# EasyEDA Pro project Raspberry_LCD_2023-10-31_10-21-50.eprj

# Board PCB7
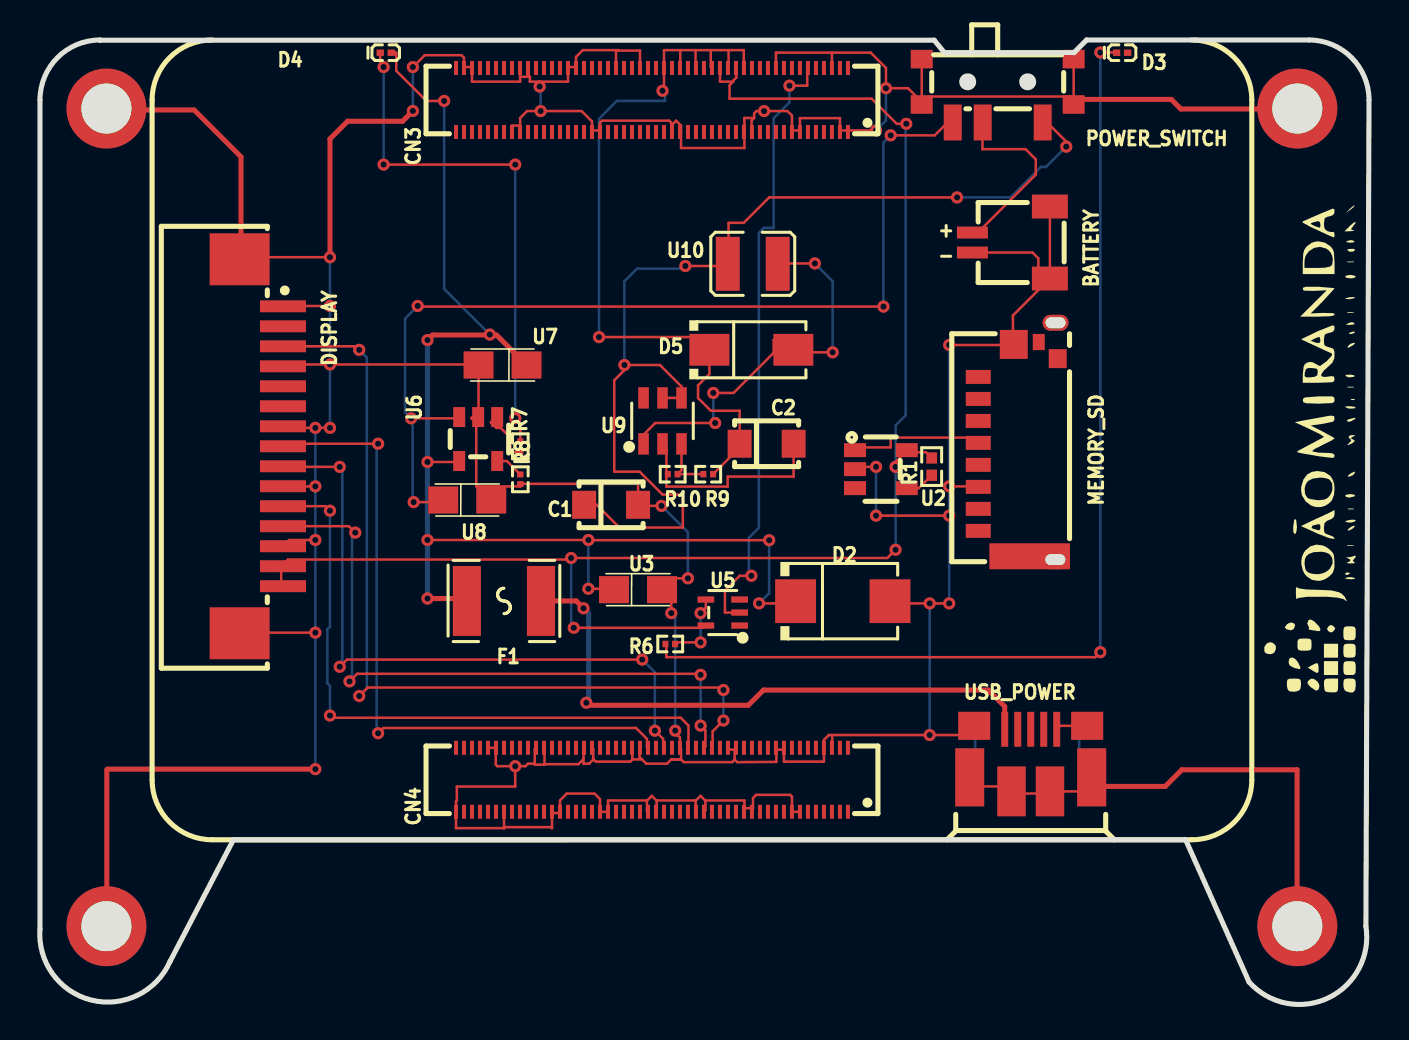
[diagram p0: board, top side]
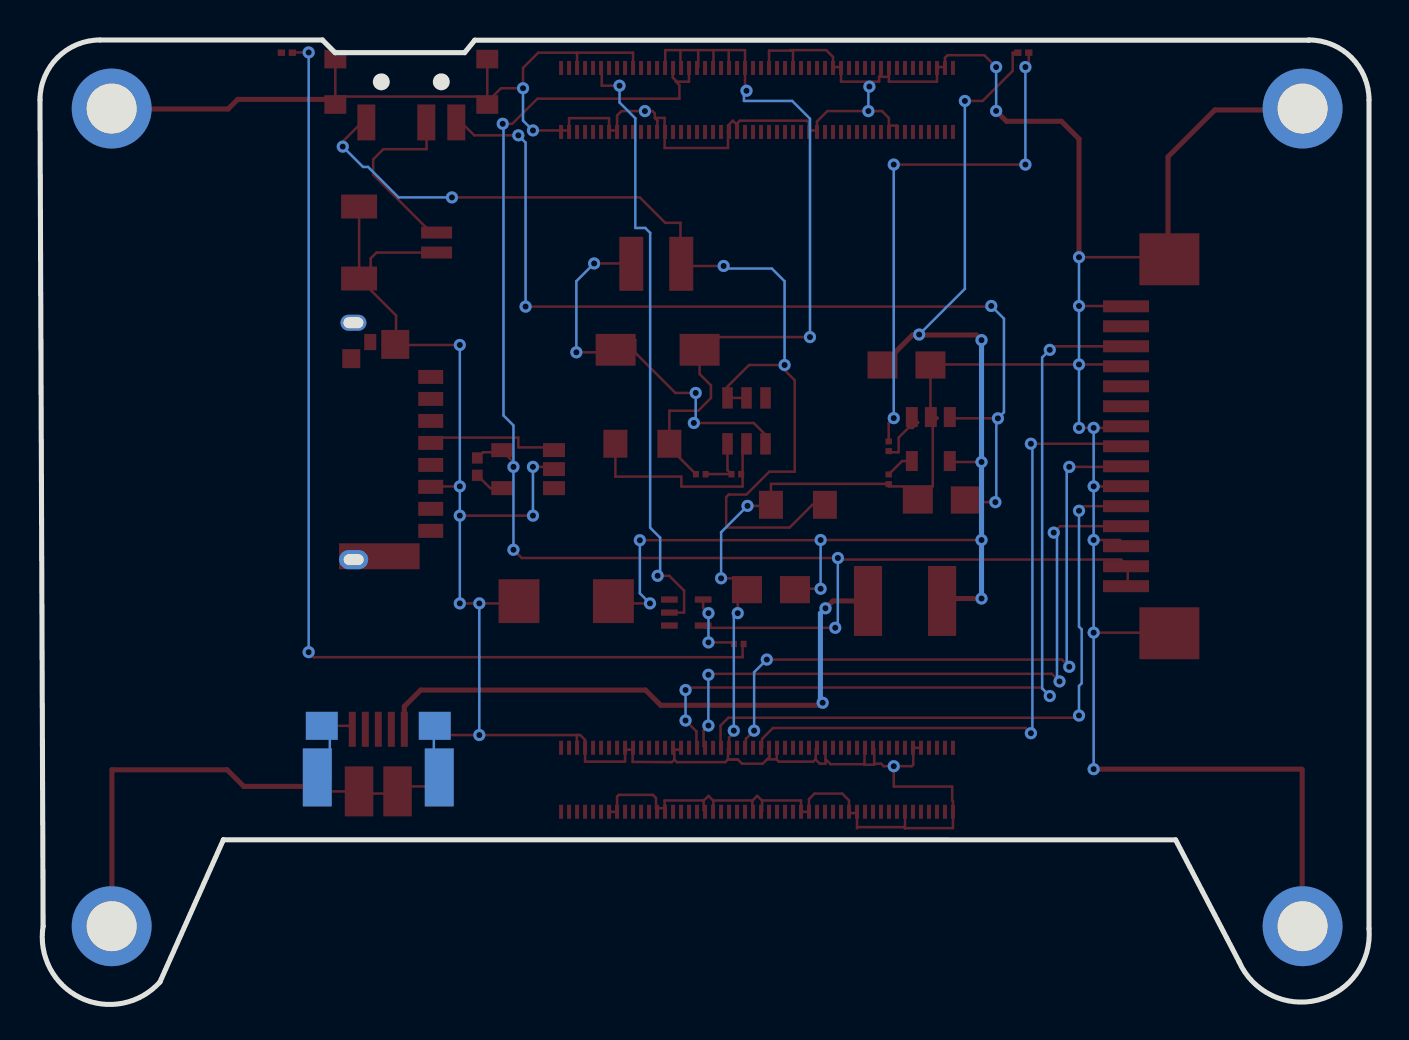
[diagram p1: board, bottom side, seen from below]

Outline 66.48 x 48.24 mm; copper layers: Top Layer, Bottom Layer. Coordinates in mm from the lower left corner of the outline.
Outline path: 0.01,45.24 0.01,3.79 arc(2.56,0.22) 6.51,2.14 9.68,8.23 57.31,8.24 60.48,1.12 arc(64.45,0.33) 66.32,3.91 66.48,45.24 arc(65.6,47.36) 63.48,48.24 52.35,48.24 51.72,47.6 45.24,47.6 44.73,48.23 3.02,48.23 3.01,48.24 arc(0.89,47.36) 0.01,45.24
Stack: Top Layer 0.035mm / Dielectric1 1.51mm FR4 er 4.5 / Bottom Layer 0.035mm

## Design rules (mm)
template: Custom Config
spacing copperThickness1oz (default): track to track 0.102, other pairs 0.152 to 0.3
spacing copperThickness2oz: track to track 0.203, other pairs 0.152 to 0.3
track width copperThickness1oz (default): min 0.127, default 0.127, max 2.54
track width copperThickness2oz: min 0.203, default 0.254, max 2.54
differential pair differentialPair (default): width min 0.127, default 0.254, max 2.54; gap min 0.152, default 0.152
via viaSize (default): diameter min 0.5, default 0.61, max 10; hole min 0.3, default 0.305, max 6.3

## Placement (name value [footprint] x y rotation side)
BATTERY  SM02B-SRSS-TB(LF)(SN)  [CONN-SMD_2P-P1.00_SM02B-SRSS-TB-LF-SN]  48.58 38.11 90 top
C1  22uF  [CAP-SMD_L3.2-W1.6]  28.57 24.99 0 top
C2  22uF  [CAP-SMD_L3.2-W1.6]  36.35 28.04 0 top
CN3  DF40C-100DS-0.4V(51)  [CONN-SMD_DF40C-100DS-0.4V-51]  30.62 45.24 0 top
CN4  DF40C-100DS-0.4V(51)  [CONN-SMD_DF40C-100DS-0.4V-51]  30.62 11.24 0 top
D2  SMBJ5.0A-TR  [SMB_L4.6-W3.6-LS5.3-RD]  40.16 20.17 0 top
D3  -  [L0201-RD]  54.13 47.6 0 top
D4  -  [L0201-RD]  17.3 47.6 0 top
D5  SS14  [SMA_L4.3-W2.5-LS5.0-RD]  35.59 32.74 0 top
DISPLAY  AFA07-S15FCC-00  [FPC-SMD_AFA07-S15FCC-00]  11.08 27.92 270 top
F1  MF-MSMF250/16X-2  [F1812]  23.21 20.18 0 top
MEMORY_SD  MUP-M617-2  [TF-SMD_MUP-M617-2]  48.93 28.17 90 top
NOREF  -  [Pad_e226]  62.89 3.91 0 top
NOREF#2  -  [Pad_e225]  3.33 3.91 0 top
NOREF#3  -  [Pad_e227]  62.89 44.81 0 top
NOREF#4  -  [Pad_e224]  3.33 44.81 0 top
POWER_SWITCH  MK-12C02-G025  [SW-SMD_MK-12C02-G025]  47.91 45.7 180 top
R1  12kΩ  [R0402]  44.61 26.9 90 top
R6  -  [R0201]  31.53 18.03 0 top
R7  4.7kΩ  [R0201]  24.03 27.92 90 top
R8  2kΩ  [R0201]  24.03 26.27 270 top
R9  110kΩ  [R0201]  33.43 26.52 0 top
R10  15kΩ  [R0201]  31.65 26.52 0 top
U2  RT9742GGJ5  [TSOT-23-5_L2.9-W1.6-P0.95-LS2.8-BR]  42.07 26.77 180 top
U3  4.7uF  [CASE-A_3216]  29.92 20.75 0 top
U5  74LVC1G07  [SOT-353_L2.1-W1.3-P0.65-LS2.3-BR]  34.16 19.6 0 top
U6  MCP73831T-2DCI/OT  [SOT-23-5_L2.9-W1.6-P0.95-LS2.8-BL]  21.93 28.28 180 top
U7  4.7uF  [CASE-A_3216]  23.14 31.98 180 top
U8  4.7uF  [CASE-A_3216]  21.38 25.23 0 top
U9  MT3608  [SOT-23-6_L2.9-W1.6-P0.95-LS2.8-BL]  31.15 29.19 0 top
U10  22uH  [IND-SMD_L3.2-W2.5_CKST322512-2.2UH]  35.66 37.04 0 top
USB_POWER  10103594-0001LF  [MICRO-USB-SMD_10103594-0001LF]  49.56 12.3 0 top

## Footprints (pads in the part's own frame, mm; a bottom-side part is the same pattern mirrored in y, then rotated)
CAP-SMD_L3.2-W1.6
  rect 1.2x1.4 smd: 1(-1.35,0) 2(1.35,0)
CASE-A_3216
  rect 1.5x1.359 smd: 1(-1.2,0) 2(1.2,0)
CONN-SMD_2P-P1.00_SM02B-SRSS-TB-LF-SN
  rect 0.6x1.55 smd: 1(-0.5,1.938) 2(0.5,1.938)
  rect 1.2x1.8 smd: 3(1.8,-1.938) 4(-1.8,-1.938)
CONN-SMD_DF40C-100DS-0.4V-51
  rect 0.2x0.7 smd: 1(9.8,-1.6) 2(9.4,-1.6) 3(9,-1.6) 4(8.6,-1.6) 5(8.2,-1.6) 6(7.8,-1.6) 7(7.4,-1.6) 8(7,-1.6) 9(6.6,-1.6) 10(6.2,-1.6) 11(5.8,-1.6) 12(5.4,-1.6) 13(5,-1.6) 14(4.6,-1.6) 15(4.2,-1.6) 16(3.8,-1.6) 17(3.4,-1.6) 18(3,-1.6) 19(2.6,-1.6) 20(2.2,-1.6) 21(1.8,-1.6) 22(1.4,-1.6) 23(1,-1.6) 24(0.6,-1.6) 25(0.2,-1.6) 26(-0.2,-1.6) 27(-0.6,-1.6) 28(-1,-1.6) 29(-1.4,-1.6) 30(-1.8,-1.6) 31(-2.2,-1.6) 32(-2.6,-1.6) 33(-3,-1.6) 34(-3.4,-1.6) 35(-3.8,-1.6) 36(-4.2,-1.6) 37(-4.6,-1.6) 38(-5,-1.6) 39(-5.4,-1.6) 40(-5.8,-1.6) 41(-6.2,-1.6) 42(-6.6,-1.6) 43(-7,-1.6) 44(-7.4,-1.6) 45(-7.8,-1.6) 46(-8.2,-1.6) 47(-8.6,-1.6) 48(-9,-1.6) 49(-9.4,-1.6) 50(-9.8,-1.6) 51(-9.8,1.6) 52(-9.4,1.6) 53(-9,1.6) 54(-8.6,1.6) 55(-8.2,1.6) 56(-7.8,1.6) 57(-7.4,1.6) 58(-7,1.6) 59(-6.6,1.6) 60(-6.2,1.6) 61(-5.8,1.6) 62(-5.4,1.6) 63(-5,1.6) 64(-4.6,1.6) 65(-4.2,1.6) 66(-3.8,1.6) 67(-3.4,1.6) 68(-3,1.6) 69(-2.6,1.6) 70(-2.2,1.6) 71(-1.8,1.6) 72(-1.4,1.6) 73(-1,1.6) 74(-0.6,1.6) 75(-0.2,1.6) 76(0.2,1.6) 77(0.6,1.6) 78(1,1.6) 79(1.4,1.6) 80(1.8,1.6) 81(2.2,1.6) 82(2.6,1.6) 83(3,1.6) 84(3.4,1.6) 85(3.8,1.6) 86(4.2,1.6) 87(4.6,1.6) 88(5,1.6) 89(5.4,1.6) 90(5.8,1.6) 91(6.2,1.6) 92(6.6,1.6) 93(7,1.6) 94(7.4,1.6) 95(7.8,1.6) 96(8.2,1.6) 97(8.6,1.6) 98(9,1.6) 99(9.4,1.6) 100(9.8,1.6)
F1812
  rect 1.407x3.499 smd: 1(-1.853,0) 2(1.853,0)
FPC-SMD_AFA07-S15FCC-00
  rect 0.6x2.3 smd: 1(-7,1.083) 2(-6,1.083) 3(-5,1.083) 4(-4,1.083) 5(-3,1.083) 6(-2,1.083) 7(-1,1.083) 8(0,1.083) 9(1,1.083) 10(1.998,1.085) 11(2.998,1.085) 12(3.998,1.085) 13(4.998,1.085) 14(6,1.083) 15(6.998,1.085)
  rect 2.6x3 smd: 16(-9.352,-1.085) 17(9.352,-1.085)
IND-SMD_L3.2-W2.5_CKST322512-2.2UH
  rect 1.2x2.7 smd: 1(-1.25,0) 2(1.25,0)
L0201-RD
  rect 0.368x0.324 smd: 1(-0.275,0) 2(0.275,0)
MICRO-USB-SMD_10103594-0001LF
  rect 0.35x1.75 smd: 1(-1.3,1.465) 2(-0.65,1.465) 3(0,1.465) 4(0.65,1.465) 5(1.3,1.465)
  custom 1.45x2.9 hole 0.7x1.2: 6(-2.775,-1.39) 6(2.775,-1.39)
  custom 1.6x1.4 hole 0.65x1.05: 6(-2.425,1.64)
  rect 1.425x2.5 smd: 6(-0.963,-1.64) 6(0.963,-1.64)
  custom 1.6x1.4 hole 1.05x0.65: 6(2.425,1.64)
Pad_e224
  round 4 hole 2.5: 1(0,0)
Pad_e225
  round 4 hole 2.5: 2(0,0)
Pad_e226
  round 4 hole 2.5: 3(0,0)
Pad_e227
  round 4 hole 2.5: 4(0,0)
R0201
  rect 0.303x0.324 smd: 1(-0.241,0) 2(0.241,0)
R0402
  rect 0.566x0.54 smd: 1(-0.433,0) 2(0.433,0)
SMA_L4.3-W2.5-LS5.0-RD
  rect 2x1.593 smd: 1(-2.1,0) 2(2.1,0)
SMB_L4.6-W3.6-LS5.3-RD
  rect 2.047x2.192 smd: 1(-2.361,0) 2(2.361,0)
SOT-23-5_L2.9-W1.6-P0.95-LS2.8-BL
  rect 0.6x1 smd: 1(-0.95,-1.1) 2(0,-1.1) 3(0.95,-1.1) 4(0.95,1.1) 5(-0.95,1.1)
SOT-23-6_L2.9-W1.6-P0.95-LS2.8-BL
  rect 0.532x1.072 smd: 1(-0.95,-1.149) 2(0,-1.149) 3(0.95,-1.149) 4(0.95,1.149) 5(0,1.149) 6(-0.95,1.149)
SOT-353_L2.1-W1.3-P0.65-LS2.3-BR
  rect 0.839x0.315 smd: 1(0.845,-0.65) 2(0.845,0) 3(0.845,0.65) 4(-0.845,0.65) 5(-0.845,-0.65)
SW-SMD_MK-12C02-G025
  rect 0.9x1.8 smd: 1(-2.25,1.583) 2(0.75,1.583) 3(2.25,1.583)
  rect 1.1x0.93 smd: 4(3.8,0.686) 5(3.8,-1.583) 6(-3.8,-1.583) 7(-3.8,0.686)
TF-SMD_MUP-M617-2
  rect 0.7x1.25 smd: 1(3.215,1.988) 2(2.115,1.988) 3(1.015,1.988) 4(-0.085,1.988) 5(-1.185,1.988) 6(-2.285,1.988) 7(-3.385,1.988) 8(-4.485,1.988)
  rect 0.81x0.6 smd: 9(4.96,-1.038)
  rect 0.95x0.9 smd: 10(4.13,-1.988)
  rect 1.45x1.4 smd: 11(4.84,0.212)
  oval 0.96x1.46 hole 0.55x1: 12(-5.925,-1.867)
  rect 1.3x4.03 smd: 12(-5.755,-0.583)
  oval 0.8x1.3 hole 0.55x1: 13(5.925,-1.877)
TSOT-23-5_L2.9-W1.6-P0.95-LS2.8-BR
  rect 1.1x0.7 smd: 1(1.294,-0.951) 2(1.294,-0.001) 3(1.294,0.951) 4(-1.294,0.951) 5(-1.294,-0.949)

## Nets
3.3V: CN3.84 CN3.86 DISPLAY.14 DISPLAY.15 R1.2 U2.5 U5.5
+3.3V: D3.2
+5V: C2.1 CN3.77 CN3.79 CN3.81 CN3.83 CN3.85 CN3.87 D5.1 R9.2
+5V_USB: D2.1 D4.2 F1.1 U3.1 U6.4 U7.1
GND: BATTERY.1 BATTERY.3 BATTERY.4 C1.2 CN3.1 CN3.2 CN3.7 CN3.8 CN3.13 CN3.14 CN3.22 CN3.23 CN3.32 CN3.33 CN3.42 CN3.43 CN3.52 CN3.53 CN3.59 CN3.60 CN3.65 CN3.66 CN3.71 CN3.74 CN3.91 CN3.98 CN4.7 CN4.8 CN4.13 CN4.14 CN4.19 CN4.20 CN4.25 CN4.26 CN4.31 CN4.32 CN4.37 CN4.38 CN4.44 CN4.50 CN4.55 CN4.56 CN4.61 CN4.62 CN4.67 CN4.68 CN4.73 CN4.74 CN4.79 CN4.85 CN4.86 CN4.91 CN4.92 CN4.97 CN4.98 D2.2 DISPLAY.1 DISPLAY.4 DISPLAY.7 DISPLAY.10 DISPLAY.13 DISPLAY.16 DISPLAY.17 MEMORY_SD.6 MEMORY_SD.11 NOREF.3 NOREF#2.2 NOREF#3.4 NOREF#4.1 POWER_SWITCH.4 POWER_SWITCH.5 POWER_SWITCH.6 POWER_SWITCH.7 R8.2 U2.2 U3.2 U6.2 U7.2 U8.2 USB_POWER.5 USB_POWER.6
BAT+: BATTERY.2 POWER_SWITCH.2
BAT_IN: C1.1 POWER_SWITCH.1 U9.4 U9.5 U10.1
DSI1_C_N: CN4.75 DISPLAY.8
DSI1_C_P: CN4.77 DISPLAY.9
DSI1_D0_N: DISPLAY.2
DSI1_D0_P: CN4.83 DISPLAY.3
NET4: POWER_SWITCH.3 U6.3 U8.1
NET19: DISPLAY.5
NET20: DISPLAY.6
NET21: CN4.80 DISPLAY.11
NET22: CN4.82 DISPLAY.12
NPWR_LED: CN3.95 U5.2
POWER_GND: U5.3
SD_CLOCK: MEMORY_SD.5
SD_DAT2: CN3.69
SD_POWER_ON: CN3.75
$1N3655: MEMORY_SD.1
$1N3691: MEMORY_SD.4 U2.1
$1N3772: R1.1 U2.4
$1N3962: MEMORY_SD.2
$1N3973: MEMORY_SD.3
$1N4000: CN3.61
$1N4038: CN3.62
$1N4567: CN4.81
$1N5777: CN4.87
$1N5788: CN4.89
$1N5838: CN3.57
$1N9478: F1.2 USB_POWER.1
$1N9600: D3.1 R6.1
$1N9766: R6.2 U5.4
$1N10820: D4.1 R7.2
$1N10824: R7.1 U6.1
$1N10845: R8.1 U6.5
$1N11272: D5.2 U9.1 U10.2
$1N11417: R9.1 R10.2 U9.3
$1N11482: C2.2 R10.1 U9.2

Pads without a net: CN3 3 4 5 6 9 10 11 12 15 16 17 18 19 20 21 24 25 26 27 28 29 30 31 34 35 36 37 38 39 40 41 44 45 46 47 48 49 50 51 54 55 56 58 63 64 67 68 70 72 73 76 78 80 82 88 89 90 92 93 94 96 97 99 100; CN4 1 2 3 4 5 6 9 10 11 12 15 16 17 18 21 22 23 24 27 28 29 30 33 34 35 36 39 40 41 42 43 45 46 47 48 49 51 52 53 54 57 58 59 60 63 64 65 66 69 70 71 72 76 78 84 88 90 93 94 95 96 99 100; MEMORY_SD 7 8 9 10 12 13; U2 3; U5 1; U9 6; USB_POWER 2 3 4

## Via types
v1: diameter 0.61, hole 0.305, Top Layer to Bottom Layer, 87 vias

## Routing (per net, layer and track width the routed paths; a pad name or vN(x,y) marks a point on that pad's centre or on a via; arc(x,y) is an arc through that point)
3.3V: length 78.9
  Top Layer w0.127: 43.29,27.62 42.8,27.13 v1(42.8,26.88) ; 43.29,27.62 44.32,27.62 44.61,27.33 ; 43.29,27.62 43.29,27.65 U2.5 ; 34.67,46.15 34.67,46.2 34.83,46.36 34.83,46.82 CN3.86 ; 34.67,46.15 34.02,46.15 34.02,46.83 CN3.84 ; 34.67,46.15 34.5,45.98 34.5,45.3 41.6,45.3 42.86,44.04 v1(43.34,44.04) ; 12.07,21.91 12.07,21.01 DISPLAY.15 ; 12.07,21.91 12.41,22.25 26.5,22.25 v1(26.57,22.33) 42.39,22.33 v1(42.8,22.74) ; 12.07,21.91 DISPLAY.14 ; v1(26.71,18.84) 33.2,18.84 33.31,18.95
  Bottom Layer w0.127: v1(26.71,18.84) 26.58,18.96 26.58,22.32 v1(26.57,22.33) ; v1(43.34,44.04) 43.3,44.08 43.3,29.46 42.8,28.96 v1(42.8,26.88) v1(42.8,22.74)
+5V: length 40.2
  Top Layer w0.127: CN3.85 34.45,46.86 34.45,47.73 ; 32.03,47.73 31.22,47.73 CN3.77 31.22,45.77 v1(31.14,45.69) ; 32.03,47.73 32.03,46.85 CN3.79 ; 32.03,47.73 32.8,47.73 ; CN3.81 32.8,46.86 32.8,47.73 ; 33.56,47.73 33.56,46.89 CN3.83 ; 33.56,47.73 34.45,47.73 ; 33.56,47.73 32.8,47.73 ; CN3.87 35.21,46.84 35.21,47.73 34.45,47.73 ; v1(27.97,33.38) 32.85,33.38 D5.1 33.49,31.53 32.92,30.96 32.92,30.33 33.56,29.69 35,29.69 C2.1 35,27.85 R9.2
  Bottom Layer w0.127: v1(31.15,45.7) 31.27,45.57 31.27,45.19 28.86,45.19 27.97,44.3 v1(27.97,33.38)
+5V_USB: length 65.1
  Top Layer w0.127: v1(36.48,23.22) 27.45,23.22 v1(27.44,23.23) v1(19.39,23.23) ; U3.1 28.68,20.79 v1(27.44,20.79) ; v1(20.22,45.19) 19.33,45.19 17.83,46.69 17.83,47.6 D4.2 ; v1(19.39,27.13) 20.93,27.13 U6.4 ; v1(35.97,20.06) 37.69,20.06 D2.1
  Top Layer w0.254: v1(19.39,20.3) 21.24,20.3 F1.1 ; v1(19.39,33.23) 19.65,33.48 22.49,33.48 v1(22.51,33.51) 22.53,33.48 22.84,33.48 U7.1
  Bottom Layer w0.127: v1(22.51,33.5) 20.22,35.79 v1(20.22,45.19) ; v1(35.97,20.06) 36.48,20.56 v1(36.48,23.22) ; v1(27.44,20.79) v1(27.44,23.23)
  Bottom Layer w0.254: v1(19.39,33.23) v1(19.39,27.13) v1(19.39,23.23) v1(19.39,20.3)
GND: length 358.1
  Top Layer w0.127: DISPLAY.4 12.25,32.01 v1(14.51,32.01) 21.92,32.01 U7.2 21.94,29.68 21.59,29.32 ; CN3.22 32.07,43.63 ; 32.07,43.63 32.07,42.83 35.24,42.83 35.24,43.63 ; 32.07,43.63 32.07,43.95 31.83,44.2 31.58,43.95 ; 29.63,12.25 29.63,12.24 29.53,12.14 27.81,12.14 27.68,12.27 ; 29.63,12.25 30.12,12.25 ; 29.63,12.25 29.63,12.82 CN4.73 ; 34.75,12.24 34.88,12.12 36.84,12.13 36.84,12.72 36.82,12.74 ; 34.75,12.24 34.75,12.74 ; 34.75,12.24 34.63,12.12 32.21,12.12 32.07,12.25 ; 39.62,47.6 41.56,47.6 42.32,46.84 v1(42.32,45.82) 43.42,45.82 43.98,45.26 44.11,45.26 ; 39.62,47.6 CN3.98 ; 39.62,47.6 36.82,47.6 36.82,47.59 CN3.91 ; 37.62,43.71 37.62,44.45 37.39,44.68 v1(36.23,44.68) 35.84,44.68 35.73,44.56 35.73,44.34 ; 37.62,43.71 CN3.8 ; 37.62,43.71 38.02,43.71 ; 24.76,12.04 24.76,11.99 25.24,11.99 25.24,12.02 ; 24.76,12.04 24.76,12.77 CN4.61 ; 24.76,12.04 24.41,12.04 24.29,11.91 v1(23.78,11.91) ; 33.29,10.19 33.29,10.2 35.24,10.2 35.24,10.2 35.24,9.81 ; 33.29,10.19 33.29,9.71 CN4.19 ; 33.29,10.19 33.05,10.43 32.8,10.19 ; DISPLAY.13 12.47,23.23 v1(13.78,23.23) ; v1(31.1,24.93) 29.92,24.93 29.92,26.04 24.16,26.04 24.03,25.91 ; CN4.98 39.63,12.85 39.63,13.47 ; v1(32.42,21.31) 31.66,21.31 31.1,20.74 ; CN4.56 22.8,12.82 ; 22.8,12.82 22.8,12.83 22.8,12.83 CN4.55 ; 22.8,12.82 22.8,11.99 22.88,11.91 v1(23.78,11.91) ; CN3.33 27.62,43.71 ; 27.62,43.71 27.62,44.16 27.1,44.68 v1(25.05,44.68) 24.37,44.68 24.02,44.34 24.02,43.95 ; 27.62,43.71 28.02,43.71 ; CN4.86 34.82,12.81 34.75,12.74 ; 37.22,12.74 36.82,12.74 ; 37.22,12.74 CN4.92 ; 37.22,12.74 37.22,12.14 39.22,12.14 CN4.97 39.21,12.85 39.22,12.86 39.22,13.23 39.46,13.47 39.63,13.47 ; 36.82,12.74 CN4.91 ; 30.36,10.19 30.36,9.69 CN4.26 ; 30.36,10.19 30.36,10.2 30.36,10.2 28.42,10.2 CN4.31 CN4.32 28.02,10.27 27.74,10.54 26.36,10.54 26.02,10.21 26.02,9.57 25.62,9.57 ; 30.36,10.19 30.61,10.43 30.85,10.19 ; 23.22,8.82 23.22,8.81 23.27,8.86 25.57,8.86 25.62,8.82 25.62,9.57 ; 23.22,8.82 20.82,8.82 CN4.50 20.82,10.16 20.86,10.2 20.86,10.9 23.78,10.9 v1(23.78,11.91) ; 23.22,8.82 CN4.44 ; 24.02,43.95 23.62,43.95 CN3.43 ; 24.02,43.95 24.02,43.64 CN3.42 ; 32.07,12.25 32.07,12.24 31.59,12.24 31.58,12.25 ; 32.07,12.25 32.07,12.78 CN4.79 32.02,13.34 31.78,13.58 v1(31.78,13.69) ; 32.07,12.25 31.58,12.25 ; 35.67,9.81 35.62,9.76 CN4.13 ; 35.67,9.81 35.24,9.81 ; 35.67,9.81 35.67,10.32 35.83,10.48 37.53,10.48 37.62,10.39 CN4.8 CN4.7 ; CN4.67 27.19,12.81 27.19,12.27 ; 24.51,46.39 24.02,46.39 ; 24.51,46.39 24.38,46.52 24.38,46.8 CN3.60 ; 24.51,46.39 24.51,46.15 25,46.15 ; 24.02,46.39 24.02,46.15 21.62,46.15 21.62,46.88 21.22,46.88 ; 24.02,46.39 24.02,46.83 CN3.59 ; 34.75,12.74 34.51,12.74 CN4.85 ; USB_POWER.6 51.04,13.93 USB_POWER.5 ; CN3.71 28.82,47.7 28.95,47.7 ; USB_POWER.6 48.6,10.55 ; 48.6,10.55 48.24,10.9 USB_POWER.6 ; 48.6,10.55 50.42,10.55 USB_POWER.6 52.09,10.65 USB_POWER.6 ; USB_POWER.6 46.67,13.47 v1(44.51,13.47) 39.63,13.47 ; 21.22,46.88 CN3.52 ; 21.22,46.88 21.22,47.35 21.09,47.47 19.25,47.47 v1(18.66,46.88) ; U8.2 21.9,25.91 ; 21.9,25.91 24.03,25.91 ; 21.9,25.91 21.83,25.91 21.83,29.08 21.59,29.32 ; 31.58,43.95 31.58,43.71 31.62,43.71 CN3.23 ; 31.58,43.95 31.58,44.09 31.47,44.2 28.13,44.2 28.02,44.09 28.02,43.71 ; 31.58,12.25 31.37,12.04 30.33,12.04 30.12,12.25 ; 30.12,12.25 29.99,12.38 29.99,12.81 CN4.74 ; 27.19,12.27 26.94,12.02 25.24,12.02 ; 27.19,12.27 27.19,12.04 27.48,12.04 27.68,12.24 27.68,12.27 ; U2.2 40.88,26.88 v1(41.82,26.88) ; 25.62,9.57 CN4.38 ; 21.59,29.32 21.87,29.32 U6.2 ; v1(41.82,43.71) 40.42,43.71 ; 40.42,43.71 40.02,43.71 ; 40.42,43.71 CN3.1 ; 40.02,43.71 40.02,44.33 38.02,44.33 38.02,43.71 ; 40.02,43.71 CN3.2 ; 31.1,20.74 31.58,20.26 v1(31.58,19.57) ; 31.1,20.74 U3.2 ; 25.24,12.02 25.24,12.81 CN4.62 ; 28.95,47.7 28.95,47.73 27.16,47.73 26.82,47.39 26.82,46.88 ; 28.95,47.7 30.02,47.7 CN3.74 ; BATTERY.3 BATTERY.4 ; BATTERY.4 49.94,36.88 49.94,37.31 49.65,37.6 BATTERY.1 ; BATTERY.4 48.67,34.46 48.67,33.05 MEMORY_SD.11 48.68,32.98 v1(45.48,32.98) ; CN3.32 28.02,43.71 ; v1(14.51,34.93) 12.18,34.93 DISPLAY.1 ; 24.03,25.91 R8.2 ; DISPLAY.10 12.17,25.91 v1(13.78,25.91) ; 30.85,10.19 30.85,9.67 CN4.25 ; 30.85,10.19 30.85,10.2 30.86,10.2 32.8,10.2 32.8,10.2 32.8,10.19 ; 44.11,45.26 44.11,47.53 ; 44.11,45.26 44.24,45.14 44.51,45.41 51.56,45.41 51.71,45.26 51.71,47.53 ; v1(13.78,18.59) 10.02,18.59 DISPLAY.17 ; 25,46.15 26.42,46.15 26.42,46.88 26.82,46.88 ; 25,46.15 v1(25,45.9) ; 32.8,10.19 32.8,9.65 CN4.20 ; 27.68,12.27 27.68,12.77 CN4.68 ; CN3.14 35.24,43.63 ; 35.24,43.63 35.24,44.34 35.73,44.34 ; 26.82,46.88 CN3.66 ; 35.73,44.34 35.6,44.21 35.6,43.65 CN3.13 ; v1(45.48,20.06) v1(44.51,20.06) 42.63,20.06 D2.2 ; v1(45.48,25.91) 46.91,25.91 MEMORY_SD.6 ; 35.24,9.81 35.24,9.66 CN4.14 ; v1(14.51,37.37) 10.1,37.37 DISPLAY.16 ; v1(14.51,28.84) v1(13.78,28.84) 12.24,28.84 DISPLAY.7 ; 38.02,43.71 CN3.7 ; v1(41.82,24.45) v1(45.48,24.45)
  Top Layer w0.254: v1(13.78,11.77) 3.38,11.77 3.35,11.73 3.35,3.93 NOREF#2.2 ; 51.71,45.26 56.59,45.26 57.07,44.78 62.83,44.78 62.88,44.73 ; NOREF.3 62.88,3.92 62.88,11.73 57.12,11.73 56.29,10.9 USB_POWER.6 ; v1(18.66,44.69) 18.14,44.17 15.4,44.17 14.51,43.29 v1(14.51,37.37) ; 3.38,44.73 7.72,44.73 10.06,42.39 10.06,37.4 10.1,37.37
  Bottom Layer w0.127: v1(41.82,26.88) v1(41.82,24.45) ; v1(32.42,21.31) 32.42,23.61 v1(31.1,24.93) ; v1(41.82,43.71) 42.32,44.21 v1(42.32,45.82) ; v1(13.78,28.84) v1(13.78,25.91) v1(13.78,23.23) v1(13.78,18.59) v1(13.78,11.77) ; USB_POWER.6 51.98,11.25 USB_POWER.6 ; v1(14.51,28.84) v1(14.51,32.01) v1(14.51,34.93) v1(14.51,37.37) ; v1(18.66,46.88) v1(18.66,44.69) ; v1(31.58,19.57) 31.78,19.37 v1(31.78,13.69) ; USB_POWER.6 46.79,13.58 USB_POWER.6 ; v1(44.51,20.06) v1(44.51,13.47) ; v1(25.05,44.68) 25.05,45.86 v1(25,45.9) ; v1(45.48,20.06) v1(45.48,24.45) v1(45.48,25.91) v1(45.48,32.98)
BAT+: length 9.4
  Top Layer w0.127: BATTERY.2 46.91,38.6 49.81,41.5 49.81,42.27 49.31,42.77 47.15,42.77 47.15,44.1 POWER_SWITCH.2
BAT_IN: length 53.3
  Top Layer w0.127: U9.5 U9.4 32.1,30.9 31.02,31.98 v1(29.24,31.98) 29.24,31.72 28.73,31.22 28.73,26.64 30,26.64 31.14,25.5 32.03,25.5 32.16,25.37 32.16,23.85 28.99,23.85 27.85,24.99 C1.1 ; v1(51.34,42.9) 51.34,43.15 50.38,44.11 POWER_SWITCH.1 ; v1(45.88,40.36) 36.48,40.36 35.21,39.09 34.45,39.09 34.45,37.08 U10.1 34.3,36.93 v1(32.29,36.93)
  Bottom Layer w0.127: v1(32.29,36.93) 32.16,36.8 29.88,36.8 29.24,36.17 v1(29.24,31.98) ; v1(45.88,40.36) 48.54,40.36 50.07,41.88 50.32,41.88 v1(51.34,42.9)
DSI1_C_N: length 33.6
  Top Layer w0.127: v1(16.92,28.04) 12.29,28.04 DISPLAY.8 ; v1(16.92,13.56) 17.18,13.82 29.82,13.82 30.36,13.28 30.36,12.89 CN4.75
  Bottom Layer w0.127: v1(16.92,28.04) 16.85,27.97 16.85,13.64 v1(16.92,13.57)
DSI1_C_P: length 33.3
  Top Layer w0.127: v1(15,16.89) 15.36,17.25 v1(30.13,17.25) ; v1(15,26.88) 12.19,26.88 DISPLAY.9 ; v1(30.76,13.69) 31.18,13.28 31.18,12.74 31.22,12.74 CN4.77
  Bottom Layer w0.127: v1(30.76,13.69) 30.76,16.61 v1(30.13,17.25) ; v1(15,16.89) 15.13,17.01 15.13,26.76 v1(15,26.88)
DSI1_D0_P: length 43.1
  Top Layer w0.127: v1(15.98,32.74) 15.8,32.91 DISPLAY.3 ; CN4.83 33.65,12.87 33.65,13.66 v1(34.19,14.2) ; v1(34.19,15.72) 34.07,15.85 16.4,15.85 v1(15.98,15.42)
  Bottom Layer w0.127: v1(15.98,32.74) 16.36,32.36 16.36,15.81 v1(15.98,15.43) ; v1(34.19,14.2) v1(34.19,15.73)
NET4: length 49.6
  Top Layer w0.127: v1(18.7,25.12) 20.07,25.12 U8.1 ; U6.3 20.91,29.31 v1(18.57,29.31) ; v1(18.9,34.93) 18.93,34.9 v1(42.19,34.9) ; v1(42.56,43.47) 44.76,43.47 45.41,44.11 POWER_SWITCH.3
  Bottom Layer w0.127: v1(18.7,25.12) 18.65,25.17 18.65,29.23 v1(18.57,29.31) 18.27,29.62 18.27,34.3 v1(18.9,34.93) ; v1(42.56,43.47) 42.19,43.1 v1(42.19,34.9)
NET21: length 32.1
  Top Layer w0.127: v1(14.51,24.69) 14.29,24.92 DISPLAY.11 ; CN4.80 32.44,12.86 32.44,13.95 32.05,14.34 14.62,14.34 v1(14.51,14.45)
  Bottom Layer w0.127: v1(14.51,14.45) 14.51,15.93 14.38,16.06 14.38,18.76 14.51,18.89 v1(14.51,24.69)
NET22: length 32.8
  Top Layer w0.127: v1(33.05,16.48) 33,16.54 15.87,16.54 v1(15.49,16.15) ; v1(33.05,13.94) 33.29,13.7 33.29,12.91 CN4.82 ; DISPLAY.12 15.46,23.92 v1(15.78,23.6)
  Bottom Layer w0.127: v1(15.78,23.6) 15.62,23.43 15.62,16.28 v1(15.49,16.15) ; v1(33.05,16.48) v1(33.05,13.94)
NPWR_LED: length 31
  Top Layer w0.127: v1(35.59,21.44) 35.01,21.44 34.27,20.7 34.27,19.6 U5.2 ; CN3.95 38.38,46.8 38.38,45.95 v1(37.5,45.95)
  Bottom Layer w0.127: v1(37.5,45.95) 37.5,45.11 36.7,44.32 36.7,38.83 36.21,38.83 35.96,38.59 35.96,23.84 35.46,23.34 35.46,21.56 v1(35.59,21.44)
$1N3691: length 7.1
  Top Layer w0.127: U2.1 40.85,27.72 40.85,27.86 42.56,27.86 42.56,28.35 46.94,28.35 MEMORY_SD.4
$1N3772: length 1.5
  Top Layer w0.127: U2.4 43.96,25.82 R1.1
$1N9478: length 29.9
  Top Layer w0.254: USB_POWER.1 48.26,14.9 47.44,15.72 36.2,15.72 35.43,14.96 27.46,14.96 v1(27.34,15.09) ; v1(27.19,19.81) 26.83,20.18 F1.2
  Bottom Layer w0.254: v1(27.34,15.09) 27.45,15.2 27.45,19.56 v1(27.19,19.82)
$1N9600: length 53.3
  Top Layer w0.127: R6.1 31.34,17.98 31.34,17.36 52.79,17.36 v1(53.04,17.62) ; v1(53.04,47.61) 53.85,47.61 D3.1
  Bottom Layer w0.127: v1(53.04,47.61) v1(53.04,17.62)
$1N9766: length 3.6
  Top Layer w0.127: v1(33.05,18.11) 31.85,18.11 R6.2 ; 33.31,20.25 33.31,19.84 v1(33.05,19.57)
  Bottom Layer w0.127: v1(33.05,19.57) v1(33.05,18.11)
$1N10820: length 26.2
  Top Layer w0.127: R7.2 24.03,29.07 v1(23.78,29.32) ; v1(17.2,46.88) 17.03,47.05 D4.1 ; v1(23.78,42) v1(17.2,42)
  Bottom Layer w0.127: v1(17.2,42.01) v1(17.2,46.88) ; v1(23.78,29.33) v1(23.78,42.01)
$1N10824: length 3
  Top Layer w0.127: R7.1 23.98,27.62 23.54,27.62 23.54,28.35 23.05,28.84 22.83,28.84 22.56,29.11 22.83,29.38 U6.1
$1N10845: length 1.4
  Top Layer w0.127: U6.5 23.36,27.18 R8.1
$1N11272: length 21.3
  Top Layer w0.127: v1(33.69,30.58) 34.7,30.58 36.7,32.59 36.7,33.22 ; U9.1 30.2,28.49 30.78,29.08 v1(33.78,29.08) ; 36.7,33.22 37.32,32.61 v1(39.65,32.61) ; 36.7,33.22 37.62,33.22 37.74,33.1 ; U10.2 36.93,37.06 v1(38.76,37.06)
  Bottom Layer w0.127: v1(39.65,32.61) 39.65,36.17 v1(38.76,37.06) ; v1(33.78,29.08) 33.69,29.17 v1(33.69,30.58)
$1N11417: length 2.9
  Top Layer w0.127: U9.3 32.1,26.72 31.9,26.52 ; 31.9,26.52 33.18,26.52 R9.1 ; 31.9,26.52 R10.2
$1N11482: length 10.8
  Top Layer w0.127: 31.34,26.52 31.34,27.84 U9.2 ; 31.34,26.52 31.34,25.9 34.4,25.9 34.4,26.4 37.7,26.4 C2.2 ; 31.34,26.52 R10.1

## Text on the board
Top Silkscreen Layer: + | -

# Board rpi-cm4-carrier-template
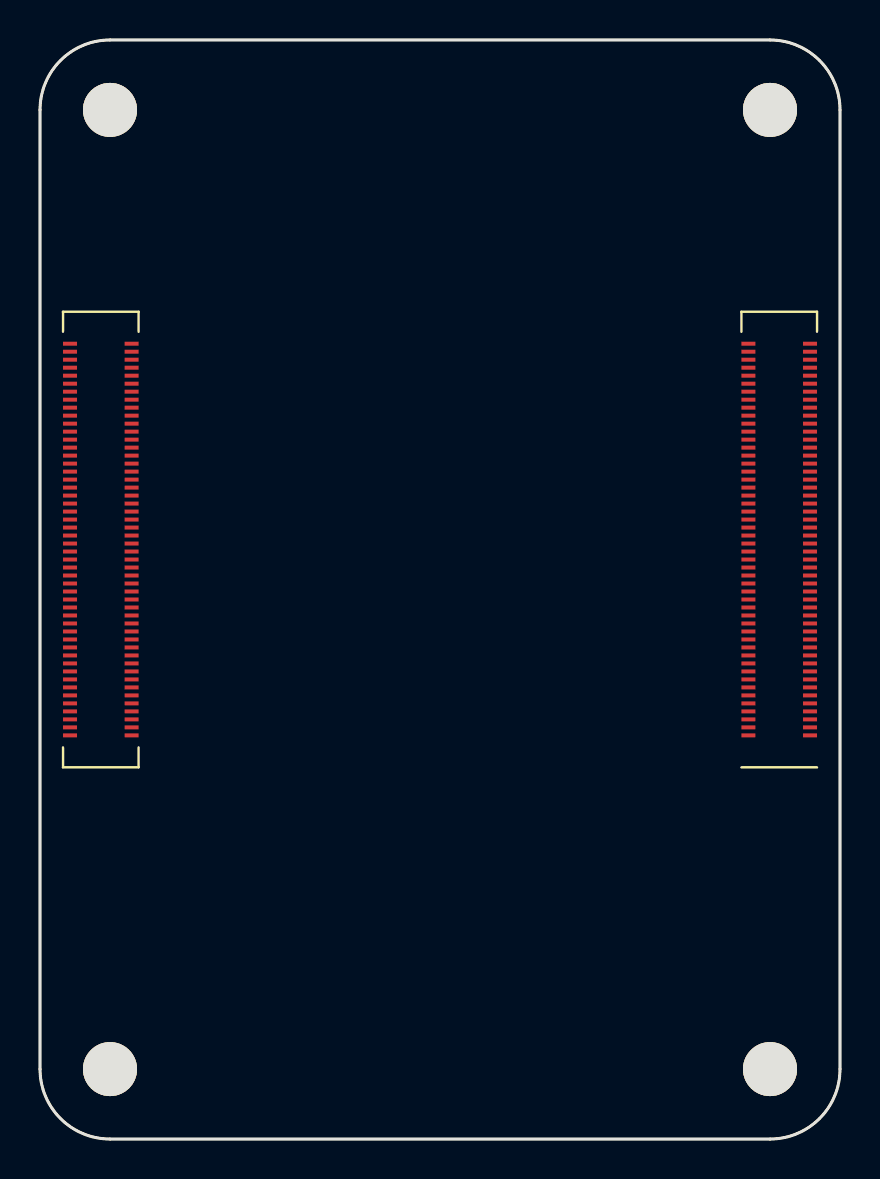
[diagram p2: board, top side]
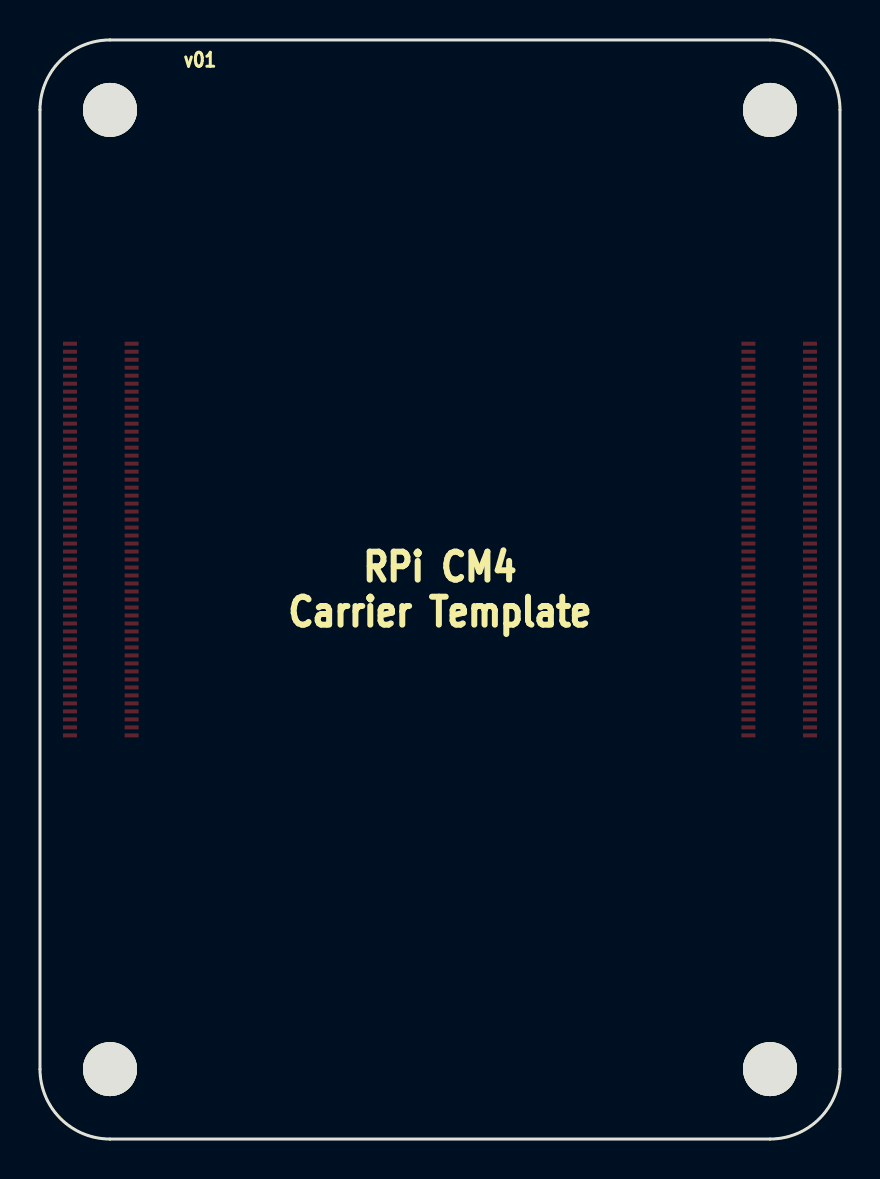
[diagram p3: board, bottom side, seen from below]

Outline 40 x 55 mm; copper layers: Top Layer, Bottom Layer. Coordinates in mm from the lower left corner of the outline.
Outline path: 0,51.5 0,3.5 arc(1.03,1.03) 3.5,0 36.5,0 arc(38.97,1.03) 40,3.5 40,51.5 arc(38.97,53.97) 36.5,55 3.5,55 arc(1.03,53.97) 0,51.5
Stack: Top Layer 0.0009mm / dielectric 1 0.0384mm FR4 er 4.5 / Bottom Layer 0.0009mm

## Design rules (mm)
spacing safeClearance (default): track to track 0.152, other pairs 0.152 to 0.3
track width trackWidth (default): min 0.127, default 0.254, max 2.54
differential pair differentialPair (default): width min 0.127, default 0.254, max 2.54; gap min 0.152, default 0.152
via viaSize (default): diameter min 0.5, default 0.61, max 10; hole min 0.3, default 0.305, max 6

## Placement (name value [footprint] x y rotation side)
MODULE1  ComputeModule4-CM4  [CM4IO:Raspberry-Pi-4-Compute-Module]  36.5 51.5 180 top

## Footprints (pads in the part's own frame, mm; a bottom-side part is the same pattern mirrored in y, then rotated)
CM4IO:Raspberry-Pi-4-Compute-Module
  rect 0.7x0.2 smd: 1(-2,31.3) 2(1.08,31.3) 3(-2,30.9) 4(1.08,30.9) 5(-2,30.5) 6(1.08,30.5) 7(-2,30.1) 8(1.08,30.1) 9(-2,29.7) 10(1.08,29.7) 11(-2,29.3) 12(1.08,29.3) 13(-2,28.9) 14(1.08,28.9) 15(-2,28.5) 16(1.08,28.5) 17(-2,28.1) 18(1.08,28.1) 19(-2,27.7) 20(1.08,27.7) 21(-2,27.3) 22(1.08,27.3) 23(-2,26.9) 24(1.08,26.9) 25(-2,26.5) 26(1.08,26.5) 27(-2,26.1) 28(1.08,26.1) 29(-2,25.7) 30(1.08,25.7) 31(-2,25.3) 32(1.08,25.3) 33(-2,24.9) 34(1.08,24.9) 35(-2,24.5) 36(1.08,24.5) 37(-2,24.1) 38(1.08,24.1) 39(-2,23.7) 40(1.08,23.7) 41(-2,23.3) 42(1.08,23.3) 43(-2,22.9) 44(1.08,22.9) 45(-2,22.5) 46(1.08,22.5) 47(-2,22.1) 48(1.08,22.1) 49(-2,21.7) 50(1.08,21.7) 51(-2,21.3) 52(1.08,21.3) 53(-2,20.9) 54(1.08,20.9) 55(-2,20.5) 56(1.08,20.5) 57(-2,20.1) 58(1.08,20.1) 59(-2,19.7) 60(1.08,19.7) 61(-2,19.3) 62(1.08,19.3) 63(-2,18.9) 64(1.08,18.9) 65(-2,18.5) 66(1.08,18.5) 67(-2,18.1) 68(1.08,18.1) 69(-2,17.7) 70(1.08,17.7) 71(-2,17.3) 72(1.08,17.3) 73(-2,16.9) 74(1.08,16.9) 75(-2,16.5) 76(1.08,16.5) 77(-2,16.1) 78(1.08,16.1) 79(-2,15.7) 80(1.08,15.7) 81(-2,15.3) 82(1.08,15.3) 83(-2,14.9) 84(1.08,14.9) 85(-2,14.5) 86(1.08,14.5) 87(-2,14.1) 88(1.08,14.1) 89(-2,13.7) 90(1.08,13.7) 91(-2,13.3) 92(1.08,13.3) 93(-2,12.9) 94(1.08,12.9) 95(-2,12.5) 96(1.08,12.5) 97(-2,12.1) 98(1.08,12.1) 99(-2,11.7) 100(1.08,11.7) 101(31.92,31.3) 102(35,31.3) 103(31.92,30.9) 104(35,30.9) 105(31.92,30.5) 106(35,30.5) 107(31.92,30.1) 108(35,30.1) 109(31.92,29.7) 110(35,29.7) 111(31.92,29.3) 112(35,29.3) 113(31.92,28.9) 114(35,28.9) 115(31.92,28.5) 116(35,28.5) 117(31.92,28.1) 118(35,28.1) 119(31.92,27.7) 120(35,27.7) 121(31.92,27.3) 122(35,27.3) 123(31.92,26.9) 124(35,26.9) 125(31.92,26.5) 126(35,26.5) 127(31.92,26.1) 128(35,26.1) 129(31.92,25.7) 130(35,25.7) 131(31.92,25.3) 132(35,25.3) 133(31.92,24.9) 134(35,24.9) 135(31.92,24.5) 136(35,24.5) 137(31.92,24.1) 138(35,24.1) 139(31.92,23.7) 140(35,23.7) 141(31.92,23.3) 142(35,23.3) 143(31.92,22.9) 144(35,22.9) 145(31.92,22.5) 146(35,22.5) 147(31.92,22.1) 148(35,22.1) 149(31.92,21.7) 150(35,21.7) 151(31.92,21.3) 152(35,21.3) 153(31.92,20.9) 154(35,20.9) 155(31.92,20.5) 156(35,20.5) 157(31.92,20.1) 158(35,20.1) 159(31.92,19.7) 160(35,19.7) 161(31.92,19.3) 162(35,19.3) 163(31.92,18.9) 164(35,18.9) 165(31.92,18.5) 166(35,18.5) 167(31.92,18.1) 168(35,18.1) 169(31.92,17.7) 170(35,17.7) 171(31.92,17.3) 172(35,17.3) 173(31.92,16.9) 174(35,16.9) 175(31.92,16.5) 176(35,16.5) 177(31.92,16.1) 178(35,16.1) 179(31.92,15.7) 180(35,15.7) 181(31.92,15.3) 182(35,15.3) 183(31.92,14.9) 184(35,14.9) 185(31.92,14.5) 186(35,14.5) 187(31.92,14.1) 188(35,14.1) 189(31.92,13.7) 190(35,13.7) 191(31.92,13.3) 192(35,13.3) 193(31.92,12.9) 194(35,12.9) 195(31.92,12.5) 196(35,12.5) 197(31.92,12.1) 198(35,12.1) 199(31.92,11.7) 200(35,11.7)
  round 2.7 hole 2.7: 201(33,48) 202(33,0) 203(0,48) 204(0,0)

## Nets
NET-(MODULE1-PAD1): MODULE1.1
NET-(MODULE1-PAD2): MODULE1.2
NET-(MODULE1-PAD3): MODULE1.3
NET-(MODULE1-PAD4): MODULE1.4
NET-(MODULE1-PAD5): MODULE1.5
NET-(MODULE1-PAD6): MODULE1.6
NET-(MODULE1-PAD7): MODULE1.7
NET-(MODULE1-PAD8): MODULE1.8
NET-(MODULE1-PAD9): MODULE1.9
NET-(MODULE1-PAD10): MODULE1.10
NET-(MODULE1-PAD11): MODULE1.11
NET-(MODULE1-PAD12): MODULE1.12
NET-(MODULE1-PAD13): MODULE1.13
NET-(MODULE1-PAD14): MODULE1.14
NET-(MODULE1-PAD15): MODULE1.15
NET-(MODULE1-PAD16): MODULE1.16
NET-(MODULE1-PAD17): MODULE1.17
NET-(MODULE1-PAD18): MODULE1.18
NET-(MODULE1-PAD19): MODULE1.19
NET-(MODULE1-PAD20): MODULE1.20
NET-(MODULE1-PAD21): MODULE1.21
NET-(MODULE1-PAD22): MODULE1.22
NET-(MODULE1-PAD23): MODULE1.23
NET-(MODULE1-PAD24): MODULE1.24
NET-(MODULE1-PAD25): MODULE1.25
NET-(MODULE1-PAD26): MODULE1.26
NET-(MODULE1-PAD27): MODULE1.27
NET-(MODULE1-PAD28): MODULE1.28
NET-(MODULE1-PAD29): MODULE1.29
NET-(MODULE1-PAD30): MODULE1.30
NET-(MODULE1-PAD31): MODULE1.31
NET-(MODULE1-PAD32): MODULE1.32
NET-(MODULE1-PAD33): MODULE1.33
NET-(MODULE1-PAD34): MODULE1.34
NET-(MODULE1-PAD35): MODULE1.35
NET-(MODULE1-PAD36): MODULE1.36
NET-(MODULE1-PAD37): MODULE1.37
NET-(MODULE1-PAD38): MODULE1.38
NET-(MODULE1-PAD39): MODULE1.39
NET-(MODULE1-PAD40): MODULE1.40
NET-(MODULE1-PAD41): MODULE1.41
NET-(MODULE1-PAD42): MODULE1.42
NET-(MODULE1-PAD43): MODULE1.43
NET-(MODULE1-PAD44): MODULE1.44
NET-(MODULE1-PAD45): MODULE1.45
NET-(MODULE1-PAD46): MODULE1.46
NET-(MODULE1-PAD47): MODULE1.47
NET-(MODULE1-PAD48): MODULE1.48
NET-(MODULE1-PAD49): MODULE1.49
NET-(MODULE1-PAD50): MODULE1.50
NET-(MODULE1-PAD51): MODULE1.51
NET-(MODULE1-PAD52): MODULE1.52
NET-(MODULE1-PAD53): MODULE1.53
NET-(MODULE1-PAD54): MODULE1.54
NET-(MODULE1-PAD55): MODULE1.55
NET-(MODULE1-PAD56): MODULE1.56
NET-(MODULE1-PAD57): MODULE1.57
NET-(MODULE1-PAD58): MODULE1.58
NET-(MODULE1-PAD59): MODULE1.59
NET-(MODULE1-PAD60): MODULE1.60
NET-(MODULE1-PAD61): MODULE1.61
NET-(MODULE1-PAD62): MODULE1.62
NET-(MODULE1-PAD63): MODULE1.63
NET-(MODULE1-PAD64): MODULE1.64
NET-(MODULE1-PAD65): MODULE1.65
NET-(MODULE1-PAD66): MODULE1.66
NET-(MODULE1-PAD67): MODULE1.67
NET-(MODULE1-PAD68): MODULE1.68
NET-(MODULE1-PAD69): MODULE1.69
NET-(MODULE1-PAD70): MODULE1.70
NET-(MODULE1-PAD71): MODULE1.71
NET-(MODULE1-PAD72): MODULE1.72
NET-(MODULE1-PAD73): MODULE1.73
NET-(MODULE1-PAD74): MODULE1.74
NET-(MODULE1-PAD75): MODULE1.75
NET-(MODULE1-PAD76): MODULE1.76
NET-(MODULE1-PAD77): MODULE1.77
NET-(MODULE1-PAD78): MODULE1.78
NET-(MODULE1-PAD79): MODULE1.79
NET-(MODULE1-PAD80): MODULE1.80
NET-(MODULE1-PAD81): MODULE1.81
NET-(MODULE1-PAD82): MODULE1.82
NET-(MODULE1-PAD83): MODULE1.83
NET-(MODULE1-PAD84): MODULE1.84
NET-(MODULE1-PAD85): MODULE1.85
NET-(MODULE1-PAD86): MODULE1.86
NET-(MODULE1-PAD87): MODULE1.87
NET-(MODULE1-PAD88): MODULE1.88
NET-(MODULE1-PAD89): MODULE1.89
NET-(MODULE1-PAD90): MODULE1.90
NET-(MODULE1-PAD91): MODULE1.91
NET-(MODULE1-PAD92): MODULE1.92
NET-(MODULE1-PAD93): MODULE1.93
NET-(MODULE1-PAD94): MODULE1.94
NET-(MODULE1-PAD95): MODULE1.95
NET-(MODULE1-PAD96): MODULE1.96
NET-(MODULE1-PAD97): MODULE1.97
NET-(MODULE1-PAD98): MODULE1.98
NET-(MODULE1-PAD99): MODULE1.99
NET-(MODULE1-PAD100): MODULE1.100
NET-(MODULE1-PAD101): MODULE1.101
NET-(MODULE1-PAD102): MODULE1.102
NET-(MODULE1-PAD103): MODULE1.103
NET-(MODULE1-PAD104): MODULE1.104
NET-(MODULE1-PAD105): MODULE1.105
NET-(MODULE1-PAD106): MODULE1.106
NET-(MODULE1-PAD107): MODULE1.107
NET-(MODULE1-PAD108): MODULE1.108
NET-(MODULE1-PAD109): MODULE1.109
NET-(MODULE1-PAD110): MODULE1.110
NET-(MODULE1-PAD111): MODULE1.111
NET-(MODULE1-PAD112): MODULE1.112
NET-(MODULE1-PAD113): MODULE1.113
NET-(MODULE1-PAD114): MODULE1.114
NET-(MODULE1-PAD115): MODULE1.115
NET-(MODULE1-PAD116): MODULE1.116
NET-(MODULE1-PAD117): MODULE1.117
NET-(MODULE1-PAD118): MODULE1.118
NET-(MODULE1-PAD119): MODULE1.119
NET-(MODULE1-PAD120): MODULE1.120
NET-(MODULE1-PAD121): MODULE1.121
NET-(MODULE1-PAD122): MODULE1.122
NET-(MODULE1-PAD123): MODULE1.123
NET-(MODULE1-PAD124): MODULE1.124
NET-(MODULE1-PAD125): MODULE1.125
NET-(MODULE1-PAD126): MODULE1.126
NET-(MODULE1-PAD127): MODULE1.127
NET-(MODULE1-PAD128): MODULE1.128
NET-(MODULE1-PAD129): MODULE1.129
NET-(MODULE1-PAD130): MODULE1.130
NET-(MODULE1-PAD131): MODULE1.131
NET-(MODULE1-PAD132): MODULE1.132
NET-(MODULE1-PAD133): MODULE1.133
NET-(MODULE1-PAD134): MODULE1.134
NET-(MODULE1-PAD135): MODULE1.135
NET-(MODULE1-PAD136): MODULE1.136
NET-(MODULE1-PAD137): MODULE1.137
NET-(MODULE1-PAD138): MODULE1.138
NET-(MODULE1-PAD139): MODULE1.139
NET-(MODULE1-PAD140): MODULE1.140
NET-(MODULE1-PAD141): MODULE1.141
NET-(MODULE1-PAD142): MODULE1.142
NET-(MODULE1-PAD143): MODULE1.143
NET-(MODULE1-PAD144): MODULE1.144
NET-(MODULE1-PAD145): MODULE1.145
NET-(MODULE1-PAD146): MODULE1.146
NET-(MODULE1-PAD147): MODULE1.147
NET-(MODULE1-PAD148): MODULE1.148
NET-(MODULE1-PAD149): MODULE1.149
NET-(MODULE1-PAD150): MODULE1.150
NET-(MODULE1-PAD151): MODULE1.151
NET-(MODULE1-PAD152): MODULE1.152
NET-(MODULE1-PAD153): MODULE1.153
NET-(MODULE1-PAD154): MODULE1.154
NET-(MODULE1-PAD155): MODULE1.155
NET-(MODULE1-PAD156): MODULE1.156
NET-(MODULE1-PAD157): MODULE1.157
NET-(MODULE1-PAD158): MODULE1.158
NET-(MODULE1-PAD159): MODULE1.159
NET-(MODULE1-PAD160): MODULE1.160
NET-(MODULE1-PAD161): MODULE1.161
NET-(MODULE1-PAD162): MODULE1.162
NET-(MODULE1-PAD163): MODULE1.163
NET-(MODULE1-PAD164): MODULE1.164
NET-(MODULE1-PAD165): MODULE1.165
NET-(MODULE1-PAD166): MODULE1.166
NET-(MODULE1-PAD167): MODULE1.167
NET-(MODULE1-PAD168): MODULE1.168
NET-(MODULE1-PAD169): MODULE1.169
NET-(MODULE1-PAD170): MODULE1.170
NET-(MODULE1-PAD171): MODULE1.171
NET-(MODULE1-PAD172): MODULE1.172
NET-(MODULE1-PAD173): MODULE1.173
NET-(MODULE1-PAD174): MODULE1.174
NET-(MODULE1-PAD175): MODULE1.175
NET-(MODULE1-PAD176): MODULE1.176
NET-(MODULE1-PAD177): MODULE1.177
NET-(MODULE1-PAD178): MODULE1.178
NET-(MODULE1-PAD179): MODULE1.179
NET-(MODULE1-PAD180): MODULE1.180
NET-(MODULE1-PAD181): MODULE1.181
NET-(MODULE1-PAD182): MODULE1.182
NET-(MODULE1-PAD183): MODULE1.183
NET-(MODULE1-PAD184): MODULE1.184
NET-(MODULE1-PAD185): MODULE1.185
NET-(MODULE1-PAD186): MODULE1.186
NET-(MODULE1-PAD187): MODULE1.187
NET-(MODULE1-PAD188): MODULE1.188
NET-(MODULE1-PAD189): MODULE1.189
NET-(MODULE1-PAD190): MODULE1.190
NET-(MODULE1-PAD191): MODULE1.191
NET-(MODULE1-PAD192): MODULE1.192
NET-(MODULE1-PAD193): MODULE1.193
NET-(MODULE1-PAD194): MODULE1.194
NET-(MODULE1-PAD195): MODULE1.195
NET-(MODULE1-PAD196): MODULE1.196
NET-(MODULE1-PAD197): MODULE1.197
NET-(MODULE1-PAD198): MODULE1.198
NET-(MODULE1-PAD199): MODULE1.199
NET-(MODULE1-PAD200): MODULE1.200

Pads without a net: MODULE1 201 202 203 204

## Text on the board
Bottom Silkscreen Layer: v01 | RPi CM4 / Carrier Template
User.9: Wireless / Keepout | Receptacle component options: / 1.5mm height: 2x Hirose DF40C-100DS-0.4v / OR / 3.0mm height: 2x Hirose DF40HC(3.0)-100DS-0.4v
